# Altium schematic sheet GPIO AND SERIAL.SchDoc: GPIO and Serial
size 431 x 558 mm; CheckedBy: Lance Bantoto; Engineer: Cindy Li; DocumentNumber: 20; Revision: 1; SheetNumber: 20; SheetTotal: 23
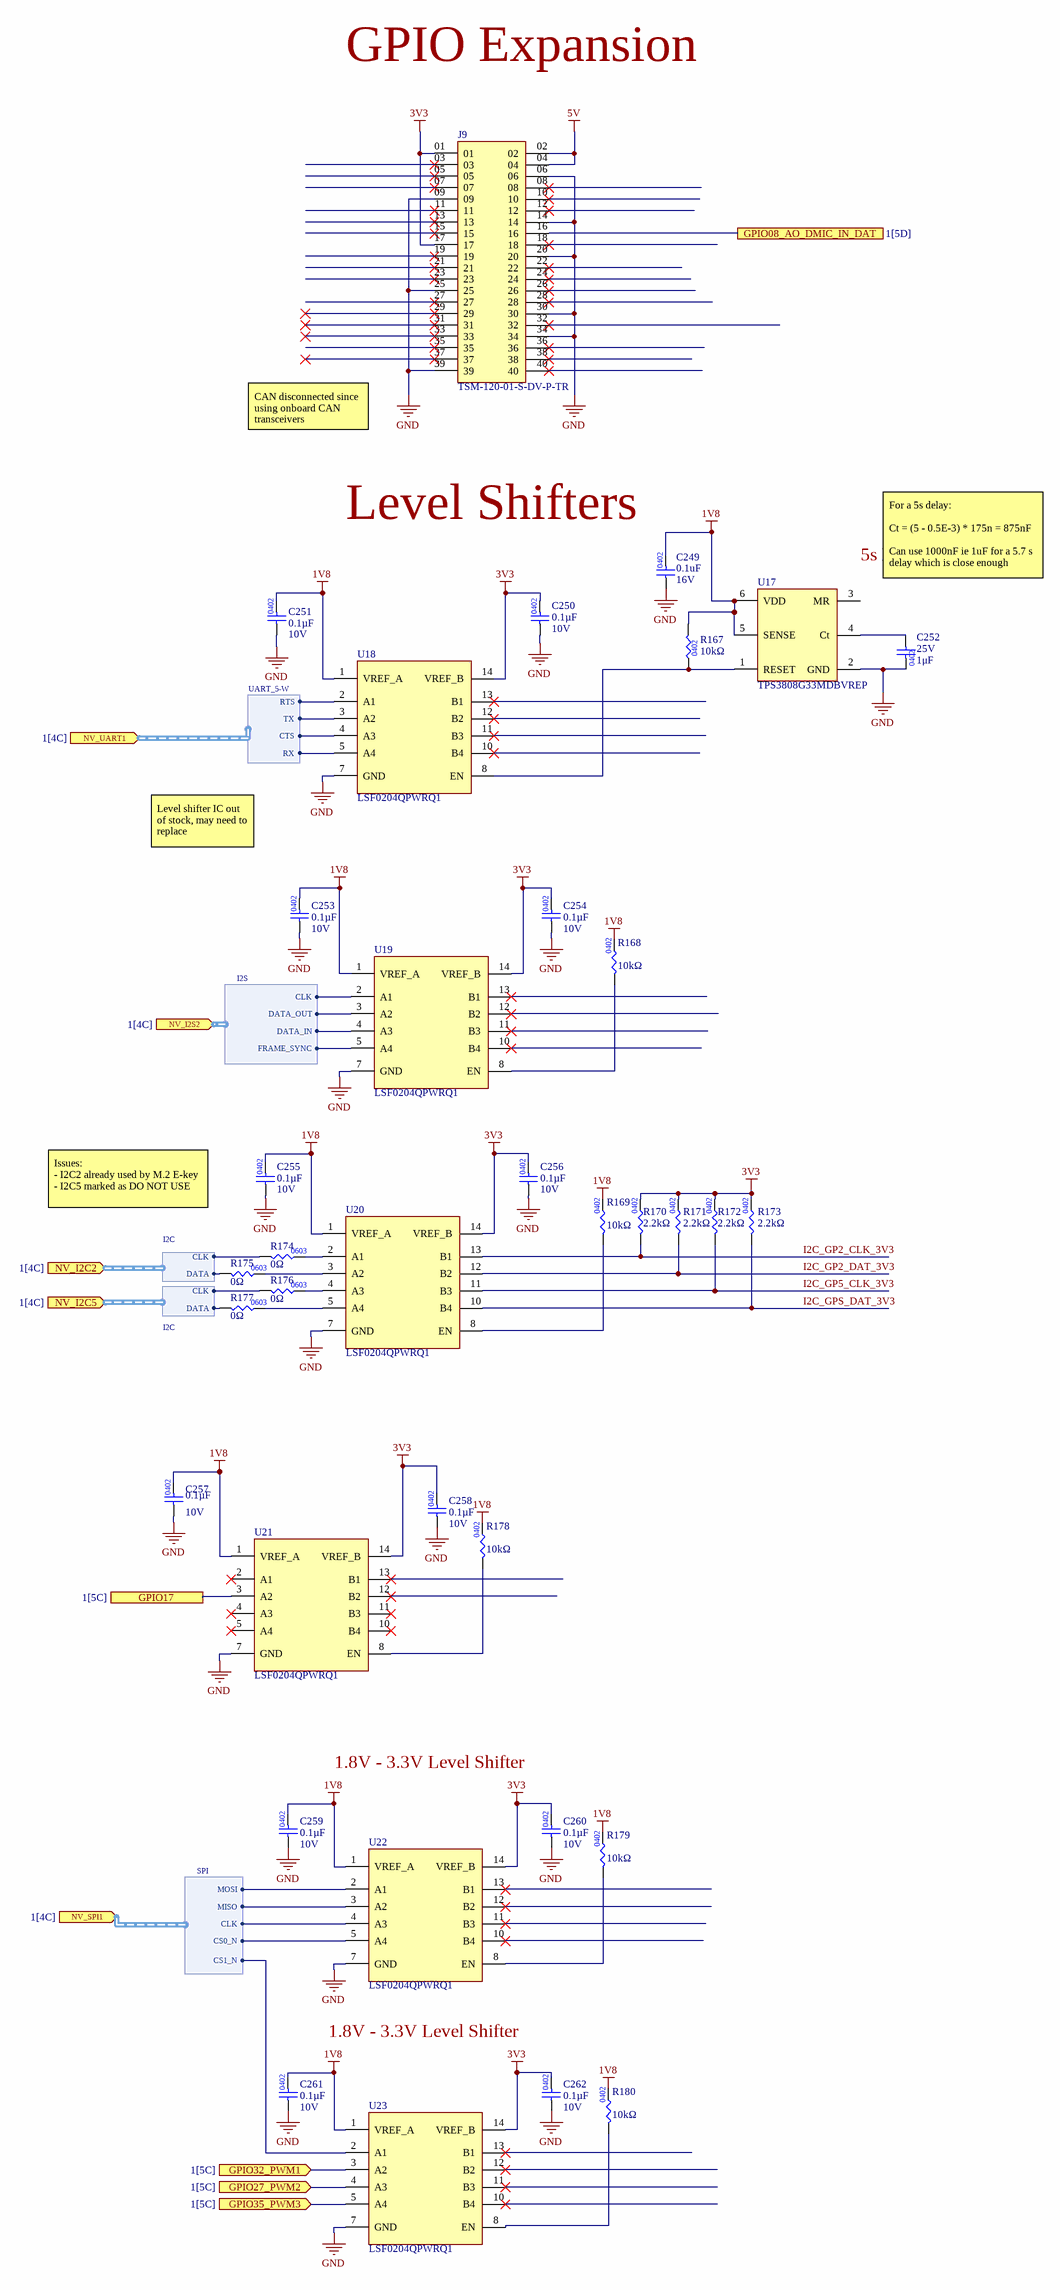
[diagram p0: GPIO AND SERIAL.SchDoc]

## Parts
C249  Capacitance: 0.1uF  Voltage Rating: 16V  [CAP0402]  (hidden comment: CAP_0.1uF_16V_X7R_0402)
C250  value 0.1µF  Voltage Rating: 10V  [CAP0402]  (hidden comment: CAP_0.1uF_10V_0402)
C251  value 0.1µF  Voltage Rating: 10V  [CAP0402]  (hidden comment: CAP_0.1uF_10V_0402)
C252  value 1μF  Voltage: 25V  [CAP0402]  (hidden comment: CAP_1uF_25V_0402)
C253  value 0.1µF  Voltage Rating: 10V  [CAP0402]  (hidden comment: CAP_0.1uF_10V_0402)
C254  value 0.1µF  Voltage Rating: 10V  [CAP0402]  (hidden comment: CAP_0.1uF_10V_0402)
C255  value 0.1µF  Voltage Rating: 10V  [CAP0402]  (hidden comment: CAP_0.1uF_10V_0402)
C256  value 0.1µF  Voltage Rating: 10V  [CAP0402]  (hidden comment: CAP_0.1uF_10V_0402)
C257  value 0.1µF  Voltage Rating: 10V  [CAP0402]  (hidden comment: CAP_0.1uF_10V_0402)
C258  value 0.1µF  Voltage Rating: 10V  [CAP0402]  (hidden comment: CAP_0.1uF_10V_0402)
C259  value 0.1µF  Voltage Rating: 10V  [CAP0402]  (hidden comment: CAP_0.1uF_10V_0402)
C260  value 0.1µF  Voltage Rating: 10V  [CAP0402]  (hidden comment: CAP_0.1uF_10V_0402)
C261  value 0.1µF  Voltage Rating: 10V  [CAP0402]  (hidden comment: CAP_0.1uF_10V_0402)
C262  value 0.1µF  Voltage Rating: 10V  [CAP0402]  (hidden comment: CAP_0.1uF_10V_0402)
J9  TSM-120-01-S-DV-P-TR  [SAMTEC_TSM-120-01-S-DV-P-TR]
R167  Resistance: 10kΩ  [RES0402]  (hidden comment: RES_10kΩ_0402_1%)
R168  value 10kΩ  [RES0402]  (hidden comment: RES_10kΩ_0402_1%)
R169  value 10kΩ  [RES0402]  (hidden comment: RES_10kΩ_0402_1%)
R170  value 2.2kΩ  [RES0402]  (hidden comment: RES_2.2kΩ_0402_5%)
R171  value 2.2kΩ  [RES0402]  (hidden comment: RES_2.2kΩ_0402_5%)
R172  value 2.2kΩ  [RES0402]  (hidden comment: RES_2.2kΩ_0402_5%)
R173  value 2.2kΩ  [RES0402]  (hidden comment: RES_2.2kΩ_0402_5%)
R174  value 0Ω  [RES0603]  (hidden comment: RES_0Ω_0603)
R175  value 0Ω  [RES0603]  (hidden comment: RES_0Ω_0603)
R176  value 0Ω  [RES0603]  (hidden comment: RES_0Ω_0603)
R177  value 0Ω  [RES0603]  (hidden comment: RES_0Ω_0603)
R178  value 10kΩ  [RES0402]  (hidden comment: RES_10kΩ_0402_1%)
R179  value 10kΩ  [RES0402]  (hidden comment: RES_10kΩ_0402_1%)
R180  value 10kΩ  [RES0402]  (hidden comment: RES_10kΩ_0402_1%)
U17  TPS3808G33MDBVREP  [TPS3808G33MDBVREP]
U18  LSF0204QPWRQ1  [14-TSSOP]
U19  LSF0204QPWRQ1  [14-TSSOP]
U20  LSF0204QPWRQ1  [14-TSSOP]
U21  LSF0204QPWRQ1  [14-TSSOP]
U22  LSF0204QPWRQ1  [14-TSSOP]
U23  LSF0204QPWRQ1  [14-TSSOP]

## Ports
GPIO08_AO_DMIC_IN_DAT (see 1[5D]), GPIO17 (see 1[5C]), GPIO27_PWM2 (in, see 1[5C]), GPIO32_PWM1 (in, see 1[5C]), GPIO35_PWM3 (in, see 1[5C]), NV_I2C2 (in, harness I2C, see 1[4C]), NV_I2C5 (in, harness I2C, see 1[4C]), NV_I2S2 (in, harness I2S, see 1[4C]), NV_SPI1 (in, harness SPI, see 1[4C]), NV_UART1 (in, harness UART_5-W, see 1[4C])

## Harnesses
UART_5-W: TX, RX, RTS, CTS
SPI: CLK, MOSI, MISO, CS0_N, CS1_N
I2S: CLK, DATA_IN, DATA_OUT, FRAME_SYNC
I2C: CLK, DATA

## Nets
1V8: C249.2 C251.2 C253.2 C255.2 C257.2 C259.2 C261.2 R167.2 R168.2 R169.2 R178.2 R179.2 R180.2 U17.5(SENSE) U17.6(VDD) U18.1(VREF_A) U19.1(VREF_A) U20.1(VREF_A) U21.1(VREF_A) U22.1(VREF_A) U23.1(VREF_A)
3V3: C250.2 C254.2 C256.2 C258.2 C260.2 C262.2 J9.01 J9.17 R170.2 R171.2 R172.2 R173.2 U18.14(VREF_B) U19.14(VREF_B) U20.14(VREF_B) U21.14(VREF_B) U22.14(VREF_B) U23.14(VREF_B)
5V: J9.02 J9.04
GND: C249.1 C250.1 C251.1 C252.1 C253.1 C254.1 C255.1 C256.1 C257.1 C258.1 C259.1 C260.1 C261.1 C262.1 J9.06 J9.09 J9.14 J9.20 J9.25 J9.30 J9.34 J9.39 U17.2(GND) U18.7(GND) U19.7(GND) U20.7(GND) U21.7(GND) U22.7(GND) U23.7(GND)
GPIO08_AO_DMIC_IN_DAT: J9.16 ; port GPIO08_AO_DMIC_IN_DAT
GPIO17: U21.3(A2) ; port GPIO17
GPIO27_PWM2: U23.4(A3) ; port GPIO27_PWM2
GPIO32_PWM1: U23.3(A2) ; port GPIO32_PWM1
GPIO35_PWM3: U23.5(A4) ; port GPIO35_PWM3
I2C_GP2_CLK_3V3: R170.1 U20.13(B1)
I2C_GP2_DAT_3V3: R171.1 U20.12(B2)
I2C_GP5_CLK_3V3: R172.1 U20.11(B3)
I2C_GPS_DAT_3V3: R173.1 U20.10(B4)
NetC252_2: C252.2 U17.4(Ct)
NetR167_1: R167.1 U17.1(RESET) U18.8(EN)
NetR168_1: R168.1 U19.8(EN)
NetR169_1: R169.1 U20.8(EN)
NetR174_1: R174.1 ; port NV_I2C2.CLK
NetR174_2: R174.2 U20.2(A1)
NetR175_1: R175.1 ; port NV_I2C2.DATA
NetR175_2: R175.2 U20.3(A2)
NetR176_1: R176.1 ; port NV_I2C5.CLK
NetR176_2: R176.2 U20.4(A3)
NetR177_1: R177.1 ; port NV_I2C5.DATA
NetR177_2: R177.2 U20.5(A4)
NetR178_1: R178.1 U21.8(EN)
NetR179_1: R179.1 U22.8(EN)
NetR180_1: R180.1 U23.8(EN)
NetU18_2: U18.2(A1) ; port NV_UART1.RTS
NetU18_3: U18.3(A2) ; port NV_UART1.TX
NetU18_4: U18.4(A3) ; port NV_UART1.CTS
NetU18_5: U18.5(A4) ; port NV_UART1.RX
NetU19_2: U19.2(A1) ; port NV_I2S2.CLK
NetU19_3: U19.3(A2) ; port NV_I2S2.DATA_OUT
NetU19_4: U19.4(A3) ; port NV_I2S2.DATA_IN
NetU19_5: U19.5(A4) ; port NV_I2S2.FRAME_SYNC
NetU22_2: U22.2(A1) ; port NV_SPI1.MOSI
NetU22_3: U22.3(A2) ; port NV_SPI1.MISO
NetU22_4: U22.4(A3) ; port NV_SPI1.CLK
NetU22_5: U22.5(A4) ; port NV_SPI1.CS0_N
NetU23_2: U23.2(A1) ; port NV_SPI1.CS1_N

Not connected (* = marked no-connect by the designer): J9 03* 05* 07* 08* 10* 11* 12* 13* 15* 18* 19* 21* 22* 23* 24* 26* 27* 28* 29* 31* 32* 33* 35* 36* 37* 38* 40*; U17 3(MR); U18 10(B4)* 11(B3)* 12(B2)* 13(B1)*; U19 10(B4)* 11(B3)* 12(B2)* 13(B1)*; U21 2(A1)* 4(A3)* 5(A4)* 10(B4)* 11(B3)* 12(B2)* 13(B1)*; U22 10(B4)* 11(B3)* 12(B2)* 13(B1)*; U23 10(B4)* 11(B3)* 12(B2)* 13(B1)*

## Notes on the sheet
- GPIO Expansion
- CAN disconnected since using onboard CAN transceivers
- (near C249) Level Shifters
- (near U17) 5s Delay Buffer
- For a 5s delay:
  Ct = (5 - 0.5E-3) * 175n = 875nF
  Can use 1000nF ie 1uF for a 5.7 s delay which is close enough
- Level shifter IC out of stock, may need to replace
- Issues:
  - I2C2 already used by M.2 E-key
  - I2C5 marked as DO NOT USE
- 1.8V - 3.3V Level Shifter
- University of Waterloo Robotics Team
- 200 University Ave W
- REV
- PROJECT
- Waterloo, Ontario, Canada
- N2L 3G1
- DOCUMENT
- ENGINEER
- REVIEWER
- MODIFIED
- SHEET
- OF

## Library data of the parts
C249 = CAP_0.1uF_16V_X7R_0402: CAP CER 0.1UF 16V X7R 0402; Supplier 1: Digi-Key; Mounting Type: Surface Mount; Package: 0402
C250 C251 C253-C262 = CAP_0.1uF_10V_0402: CAP CER 0.1UF 10V X7R 0402; Manufacturer Part Number 1: GRM155R71A104KA01D; Manufacturer 1: Murata Electronics; Package/Footprint: 0402; Supplier Part Number 1: 490-6321-1-ND; Supplier 1: Digi-Key
C252 = CAP_1uF_25V_0402: CAP CER 1UF 25V X5R 0402; Manufacturer 1: TDK Corporation; Manufacturer Part Number 1: C1005X5R1E105K050BE; Supplier 1: Digi-Key; Supplier Part Number 1: 445-175215-1-ND; Package: 0402
J9 = TSM-120-01-S-DV-P-TR: CONN HEADER SMD 40POS 2.54MM; Manufacturer 1: Samtec Inc.; Supplier 1: Digi-Key; Supplier Part Number 1: SAM14896CT-ND; Manufacturer Part Number 1: TSM-120-01-S-DV-P-TR
R167 = RES_10kΩ_0402_1%: RES 10K OHM 1% 1/16W 0402; Manufacturer Part Number 1: RC1005F103CS; Manufacturer 1: Samsung Electro-Mechanics; Supplier 1: Digi-Key; Supplier Part Number 1: 1276-3431-1-ND; Tolerance: 1%; Package: 0402
R168 R169 R178-R180 = RES_10kΩ_0402_1%: RES SMD 10K OHM 1% 1/16W 0402; Manufacturer Part Number 1: CRCW040210K0FKTD; Manufacturer 1: Vishay Dale; Power: 0.063W, 1/16W; Package/Footprint: 0402; Supplier 1: Digi-Key; Supplier Part Number 1: 541-2955-1-ND; Mounting Type: SMD; Tolerance: 1%
R170-R173 = RES_2.2kΩ_0402_5%: RES SMD 2.2K OHM 5% 1/10W 0402; Manufacturer 1: Panasonic Electronic Components; Manufacturer Part Number 1: ERJ-2GEJ222X; Package/Footprint: 0402; Supplier Part Number 1: P2.2KJCT-ND; Supplier 1: Digi-Key; Mounting Type: SMD
R174-R177 = RES_0Ω_0603: RES 0 OHM JUMPER 1/10W 0603; Manufacturer 1: Yageo; Manufacturer Part Number 1: RC0603JR-070RL; Package/Footprint: 0603; Supplier Part Number 1: 311-0.0GRCT-ND; Supplier 1: Digi-Key; Mounting Type: SMD
U17 = TPS3808G33MDBVREP: IC SUPERVISOR 1 CHANNEL SOT23-6; Manufacturer 1: Texas Instruments; Supplier 1: Digi-Key; Supplier Part Number 1: 296-23569-1-ND; Manufacturer Part Number 1: TPS3808G33MDBVREP
U18-U23 = LSF0204QPWRQ1: Automotive 4-Bit Bidirectional Multi-Voltage Level Translator for Open-Drain or Push- Pull Interface 14-TSSOP -40 to 125; Manufacturer 1: Texas Instruments; Channels per Circuit: 4; Output Type: Open Drain, Push Pull; Data Rate: 100MBd; Voltage - VCCA: 0.8V - 4.5V; Voltage - VCCB: 1.8V - 5.5V; Manufacturer Part Number 1: LSF0204QPWRQ1; Supplier 1: Digi-Key; Supplier Part Number 1: 296-51425-1-ND; Channel Type: Bidirectional; Package: 14-TSSOP